# EAGLE design milhub (EAGLE 9.4.2)
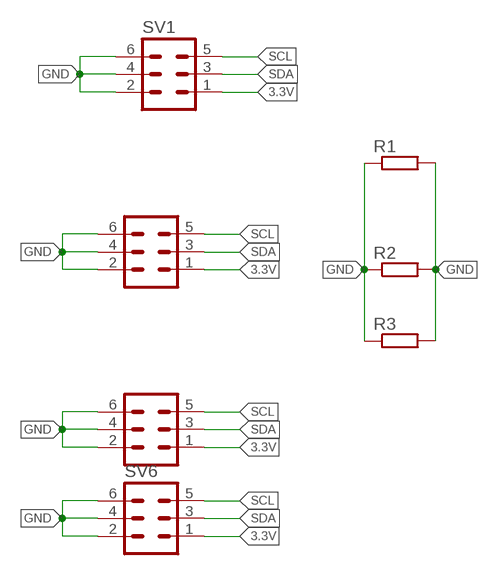
[diagram p0: schematic, sheet 1]

## Parts
R1  R-EU_0207/10  [0207/10]
R2  R-EU_0207/10  [0207/10]
R3  R-EU_0207/10  [0207/10]
SV1  ML6  [ML6]
SV3  ML6  [ML6]
SV5  ML6  [ML6]
SV6  ML6  [ML6]

## Nets
3.3V: SV1.1 SV3.1 SV5.1 SV6.1
GND: R1.1 R1.2 R2.1 R2.2 R3.1 R3.2 SV1.2 SV1.4 SV1.6 SV3.2 SV3.4 SV3.6 SV5.2 SV5.4 SV5.6 SV6.2 SV6.4 SV6.6
SCL: SV1.5 SV3.5 SV5.5 SV6.5
SDA: SV1.3 SV3.3 SV5.3 SV6.3

## Library data of the parts
R1-R3 = rcl:R-EU_: RESISTOR, European symbol; SPICEPREFIX: R
SV1 SV3 SV5 SV6 = con-ml:ML6: HARTING; OC_FARNELL: unknown; OC_NEWARK: unknown

## Board
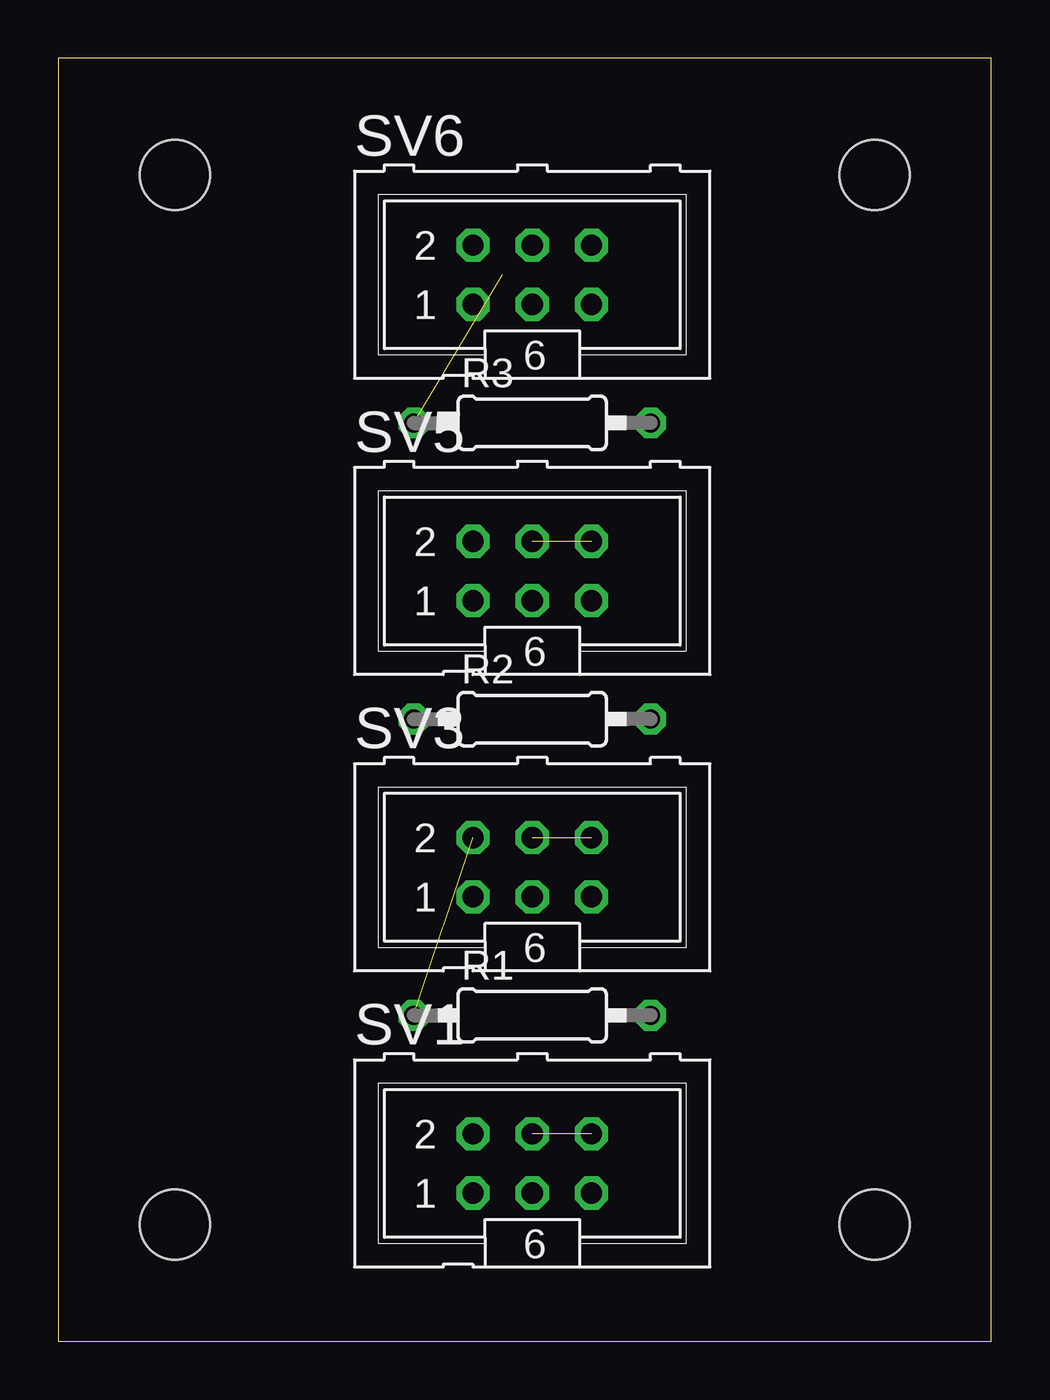
[diagram p1: board, top side]
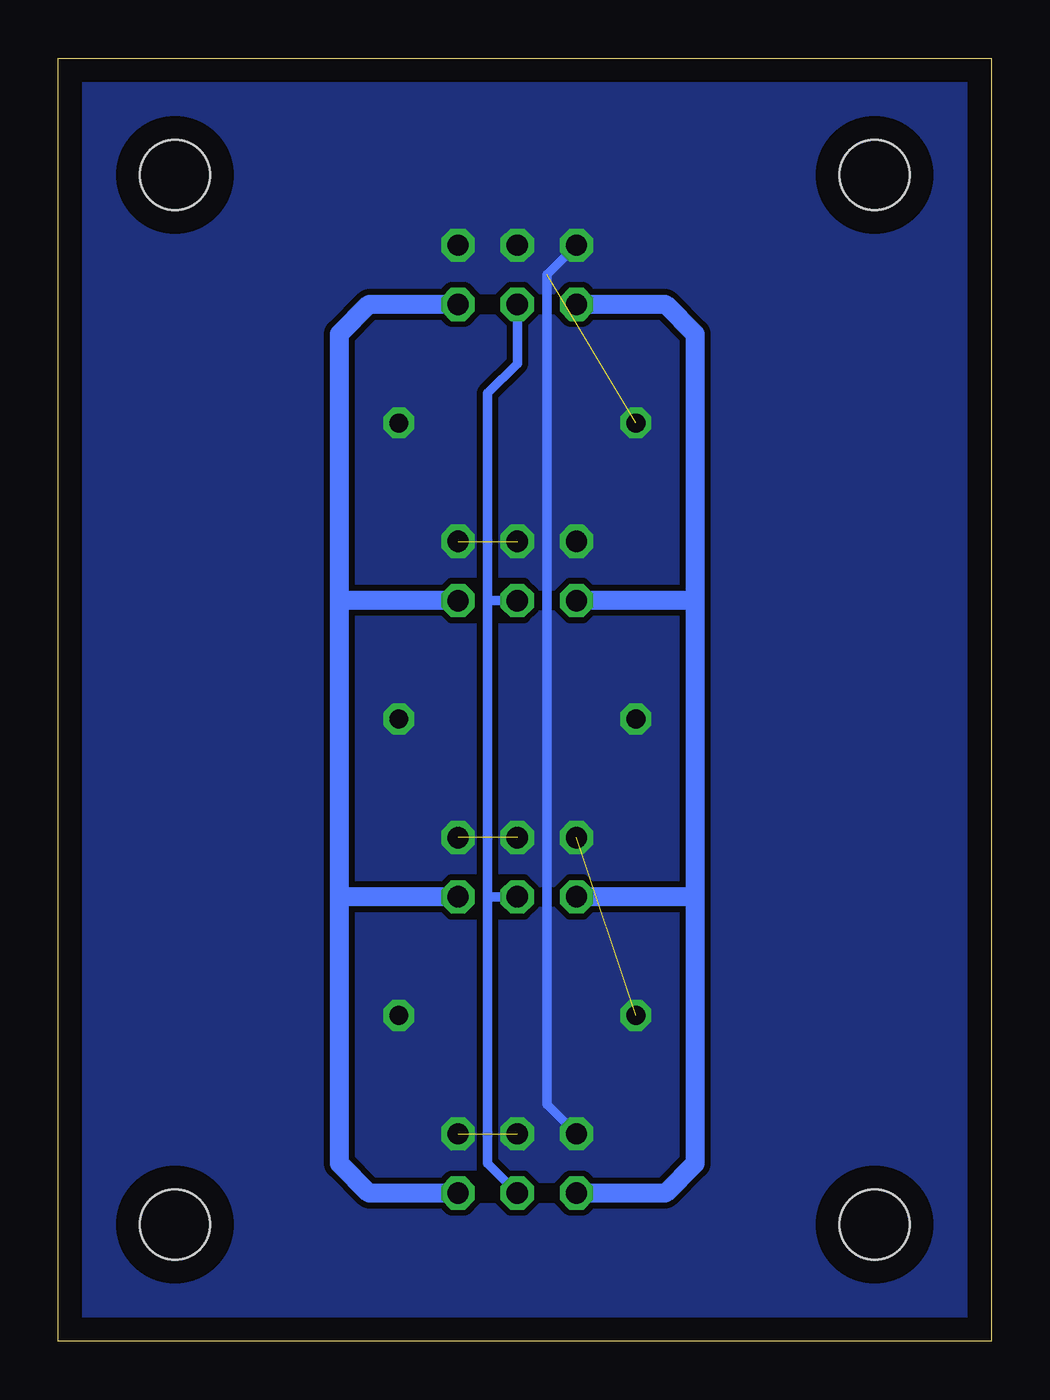
[diagram p2: board, bottom side, seen from below]

Size 40 x 55 mm. Coordinates in mm from the lower left corner, seen from the top.
Outline: 0,0 40,0 40,55 0,55 0,0
Copper layers (1*16): Top 0.035mm / dielectric 1.5mm / Bottom 0.035mm
Design rules "default": minimum track width 6mil, minimum drill 0.35mm, track to track 6mil, track to pad 6mil, pad to pad 6mil, via to via 6mil, smd to smd 6mil, copper to edge 40mil, drill to drill 6mil, minimum pad ring 10mil, minimum via ring 8mil, stop-mask expansion 4mil, vias tented up to drill 0mil, thermal gap 10mil
Holes 3 mm at 5,50 35,50 5,5 35,5

### Footprints (pad centres in the part's own frame; a part is rotated, then mirrored left to right if it is on the bottom)
0207/10 = drill 0.813 octagon: 1 -5.08,0; 2 5.08,0
ML6 = drill 0.914 octagon: 1 -2.54,-1.27; 2 -2.54,1.27; 3 0,-1.27; 4 0,1.27; 5 2.54,-1.27; 6 2.54,1.27

### Placement (x,y rotation side)
R1  20.32,13.97 0 top
R2  20.32,26.67 0 top
R3  20.32,39.37 0 top
SV1  20.32,7.62 0 top
SV3  20.32,20.32 0 top
SV5  20.32,33.02 0 top
SV6  20.32,45.72 0 top

### Tracks (layer width: path | path; a pad name or v marks a point on that pad's centre or on a via)
3.3V
  Bottom 0.813: SV6.1 13.97,44.45 12.7,43.18 12.7,31.75 | 12.7,31.75 12.7,19.05 | 12.7,19.05 12.7,7.62 13.97,6.35 SV1.1 | 12.7,19.05 SV3.1 | 12.7,31.75 SV5.1
GND  (5 unrouted)
  Bottom 0.406: SV6.2 19.05,45.72 19.05,10.16 SV1.2
  pour Bottom (isolate 0.254, no thermals): 0,0 40.64,0 40.64,54.61 0,54.61
SCL
  Bottom 0.813: SV1.5 26.67,6.35 27.94,7.62 27.94,19.05 | 27.94,19.05 27.94,31.75 | 27.94,31.75 27.94,43.18 26.67,44.45 SV6.5 | SV3.5 27.94,19.05 | SV5.5 27.94,31.75
SDA
  Bottom 0.406: 21.59,31.75 21.59,40.64 20.32,41.91 SV6.3 | 21.59,31.75 21.59,19.05 | 21.59,19.05 21.59,7.62 SV1.3 | SV3.3 21.59,19.05 | SV5.3 21.59,31.75